# Altium project Instrumented Feeding Nipple.PrjPcb
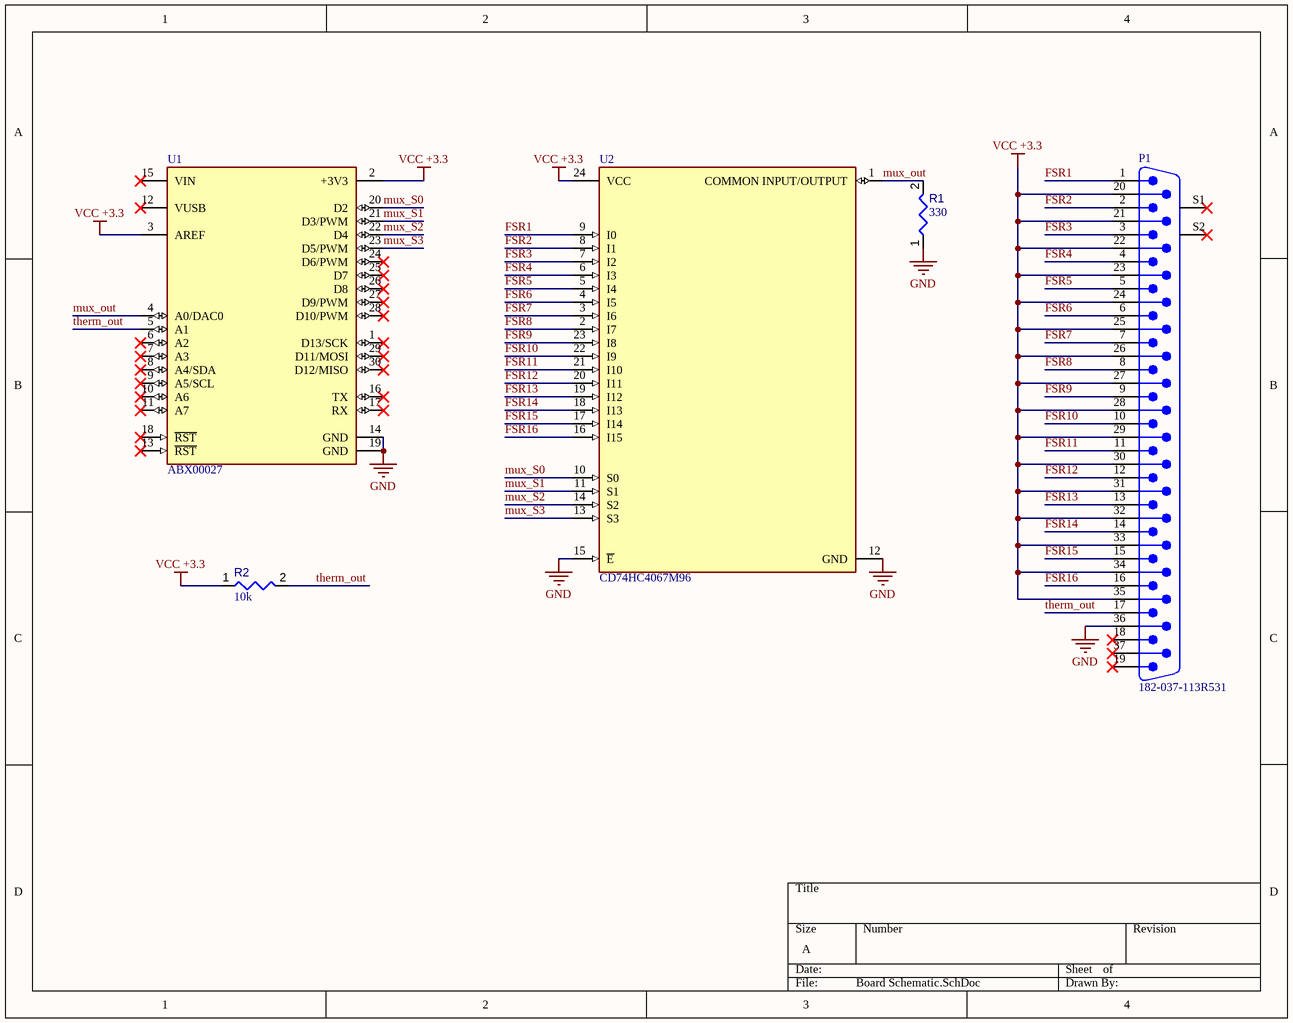
[diagram p0: Board Schematic.SchDoc]
1 sheet, 5 parts. Net scope: global (net labels, ports and power ports of the same name join across sheets).
Board file: PCB.PcbDoc

## Sheet Board Schematic.SchDoc
size A; SheetNumber: 1; SheetTotal: 1

### Parts
P1  182-037-113R531  [NORCO-182-037-113R531_V]
R1  value 330  [FP-ERJS08-MFG]  (hidden comment: ERJ-S08F3300V)
R2  value 10k  [RESC3216X60X45ML10T20]  (hidden comment: CRCW120610K0JNEA)
U1  ABX00027  [FP-ABX00027-MFG]
U2  CD74HC4067M96  [FP-DW0024A-IPC_C]

### Nets
GND: P1.36 R1.1 U1.14(GND) U1.19(GND) U2.12(GND) U2.15(~{E})
VCC +3.3: P1.20 P1.21 P1.22 P1.23 P1.24 P1.25 P1.26 P1.27 P1.28 P1.29 P1.30 P1.31 P1.32 P1.33 P1.34 P1.35 R2.1 U1.2(+3V3) U1.3(AREF) U2.24(VCC)
FSR1: P1.1 U2.9(I0)
FSR2: P1.2 U2.8(I1)
FSR3: P1.3 U2.7(I2)
FSR4: P1.4 U2.6(I3)
FSR5: P1.5 U2.5(I4)
FSR6: P1.6 U2.4(I5)
FSR7: P1.7 U2.3(I6)
FSR8: P1.8 U2.2(I7)
FSR9: P1.9 U2.23(I8)
FSR10: P1.10 U2.22(I9)
FSR11: P1.11 U2.21(I10)
FSR12: P1.12 U2.20(I11)
FSR13: P1.13 U2.19(I12)
FSR14: P1.14 U2.18(I13)
FSR15: P1.15 U2.17(I14)
FSR16: P1.16 U2.16(I15)
mux_out: R1.2 U1.4(A0/DAC0) U2.1(COMMON_INPUT/OUTPUT)
mux_S0: U1.20(D2) U2.10(S0)
mux_S1: U1.21(D3/PWM) U2.11(S1)
mux_S2: U1.22(D4) U2.14(S2)
mux_S3: U1.23(D5/PWM) U2.13(S3)
therm_out: P1.17 R2.2 U1.5(A1)

Not connected (* = marked no-connect by the designer): P1 18* 19* 37* S1* S2*; U1 1(D13/SCK)* 6(A2)* 7(A3)* 8(A4/SDA)* 9(A5/SCL)* 10(A6)* 11(A7)* 12(VUSB)* 13(~{RST})* 15(VIN)* 16(TX)* 17(RX)* 18(~{RST})* 24(D6/PWM)* 25(D7)* 26(D8)* 27(D9/PWM)* 28(D10/PWM)* 29(D11/MOSI)* 30(D12/MISO)*

### Library data of the parts
P1 = CMP-002-00072-1: Conn D-Subminiature M 37 POS 2.77mm Solder RA Thru-Hole 37 Terminal 1 Port; Connector Type: D-Sub, Plug, Signal; Gender: Male; Mounting Technology: Through Hole; Max Operating Temperature: 105°C; Min Operating Temperature: -55°C; Pins: 37
R1 = CMP-009-00184-1: Res Thick Film 1206 330 Ohm 1% 0.25W ±100ppm/°C Molded SMD Punched Carrier T/R; Voltage Rating: 200V; Min Operating Temperature: -55°C; Tolerance: 1%; Mounting Technology: Surface Mount; Max Operating Temperature: 155°C; Case/Package: 1206
R2 = CMP-009-00187-1: 250mW Thick Film Resistors 200V ±5% ±200ppm/℃ 10kΩ 1206 Chip Resistor - Surface Mount ROHS; Voltage Rating: 200V; Mounting Technology: Surface Mount; Min Operating Temperature: -55°C; Case/Package: 1206; Pins: 2; Max Operating Temperature: 155°C; Tolerance: 5%
U1 = CMP-020-00023-1: SBC, Arduino Nano 33 IOT, SAMD21G18A, 32bit, 32KB RAM, 256KB Flash, 14 I/O pins; Frequency: 48MHz; Interface: I2C, SPI, UART, USB; Max Supply Voltage: 21V; Min Supply Voltage: 4.5V; RAM Size: 32kB
U2 = CMP-016-00011-2: 5V, 16:1 mux, single channel analog multiplexer, 24-SOIC, -55 to 125C; Max Supply Voltage: 6V; Min Supply Voltage: 2V; Nominal Supply Current: 8µA; Case/Package: SOIC; Max Operating Temperature: 125°C; Min Operating Temperature: -55°C; Mounting Technology: Surface Mount; Pins: 24